# Altium schematic sheet [09] - USB.SchDoc
size A2; DocumentNumber: 9; SheetNumber: 9; SheetTotal: 18
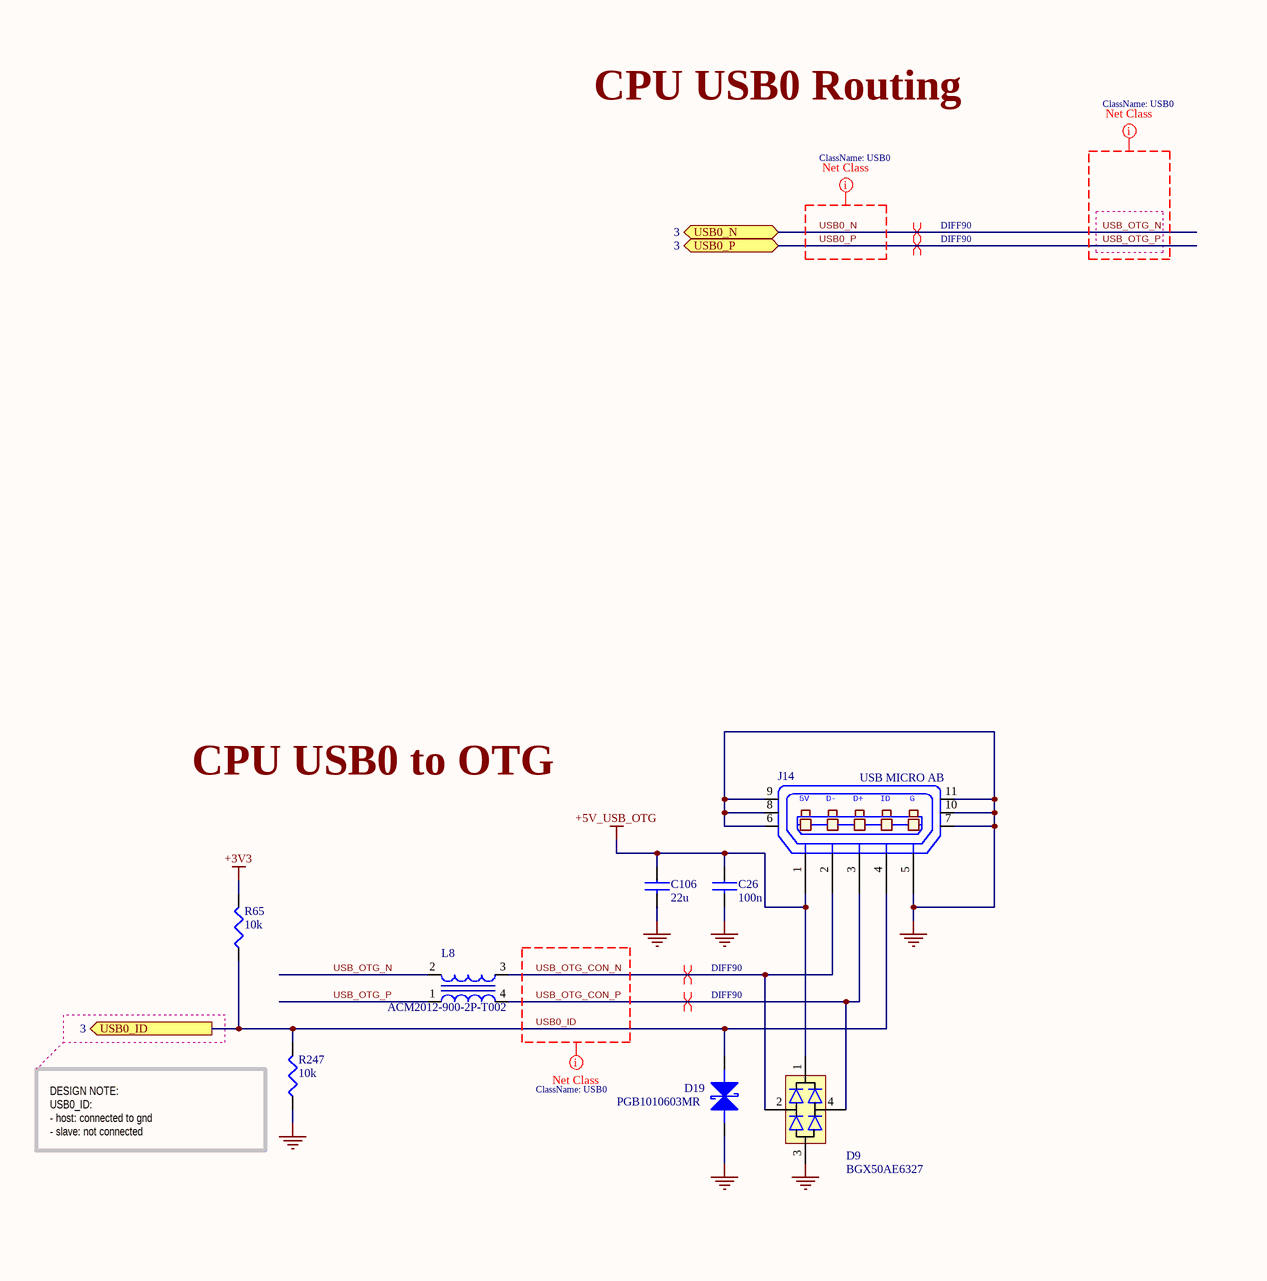
[diagram p0: [09] - USB.SchDoc, left]
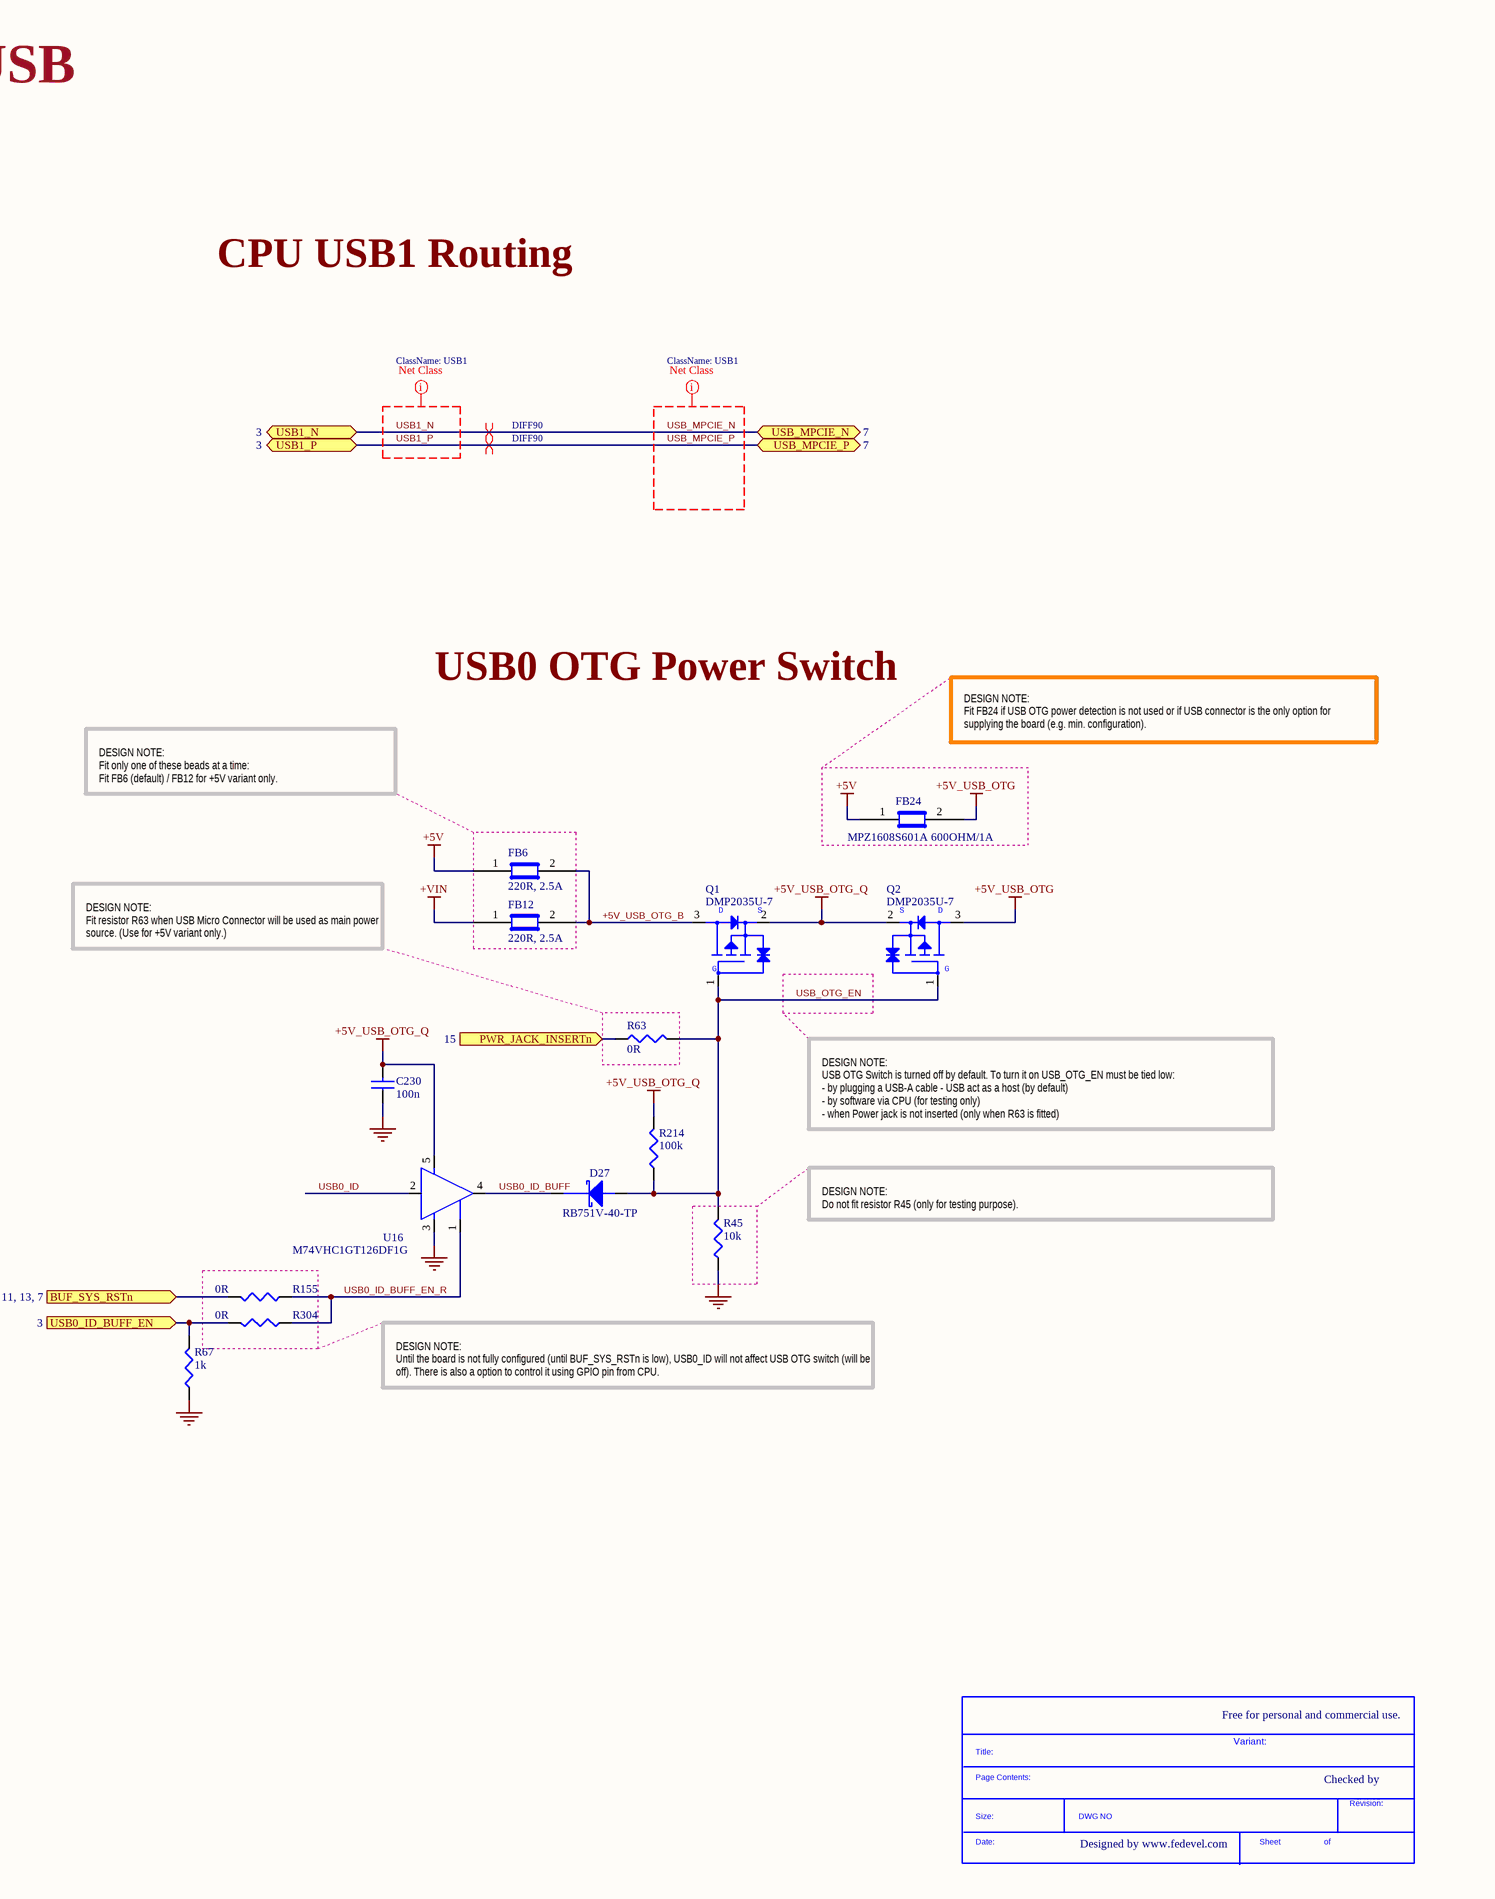
[diagram p1: [09] - USB.SchDoc, right]

## Parts
*  SDTitleBlock  (value not drawn)  (graphical)
C26  100n  [C0402]
C106  22u  [C0805]
C230  100n  [C0402]
D9  BGX50AE6327  [SOT143]
D19  PGB1010603MR  [C0603]
D27  RB751V-40-TP  [SOD323]
FB6  220R, 2.5A  [C0603]
FB12  220R, 2.5A  [C0603]
FB24  MPZ1608S601A 600OHM/1A  [C0603]
J14  USB MICRO AB  [USB_Micro_AB]
L8  ACM2012-900-2P-T002  [ACM2012]
Q1  DMP2035U-7  [SOT-23-3-123]
Q2  DMP2035U-7  [SOT-23-3-123]
R45  10k  [R0402]
R63  0R  [R0402]
R65  10k  [R0402]
R67  1k  [R0402]
R155  0R  [R0402]
R214  100k  [R0402]
R247  10k  [R0402]
R304  0R  [R0402]
U16  M74VHC1GT126DF1G  [SC70_5]

## Ports
BUF_SYS_RSTn (see 11, 13, 7), PWR_JACK_INSERTn (in, see 15), USB0_ID (out, see 3), USB0_ID_BUFF_EN (in, see 3), USB0_N (bidir, see 3), USB0_P (bidir, see 3), USB1_N (bidir, see 3), USB1_P (bidir, see 3), USB_MPCIE_N (bidir, see 7), USB_MPCIE_P (bidir, see 7)

## Nets
+3V3: R65.2
+5V: FB6.1 FB24.1
+5V_USB_OTG: C26.1 C106.1 D9.1 FB24.2 J14.1(P1) Q2.3
+5V_USB_OTG_Q: C230.2 Q1.2 Q2.2 R214.2 U16.5(VCC)
+VIN: FB12.1
GND: C26.2 C106.2 C230.1 D9.3 D19.2 J14.5(P5) J14.6 J14.7 J14.8 J14.9 J14.10 J14.11 R45.1 R67.1 R247.1 U16.3(GND)
+5V_USB_OTG_B: FB6.2 FB12.2 Q1.3
BUF_SYS_RSTn: R155.2 ; port BUF_SYS_RSTn
PWR_JACK_INSERTn: R63.1 ; port PWR_JACK_INSERTn
USB0_ID: D19.1 J14.4(P4) R65.1 R247.2 U16.2(I) ; port USB0_ID
USB0_ID_BUFF: D27.1(cathode) U16.4(O)
USB0_ID_BUFF_EN: R67.2 R304.2 ; port USB0_ID_BUFF_EN
USB0_ID_BUFF_EN_R: R155.1 R304.1 U16.1(OE#)
USB0_N: L8.2 ; port USB0_N  [also labelled USB_OTG_N]
USB0_P: L8.1 ; port USB0_P  [also labelled USB_OTG_P]
USB1_N: port USB1_N, port USB_MPCIE_N  [also labelled USB_MPCIE_N]
USB1_P: port USB1_P, port USB_MPCIE_P  [also labelled USB_MPCIE_P]
USB_OTG_CON_N: D9.2 J14.2(P2) L8.3
USB_OTG_CON_P: D9.4 J14.3(P3) L8.4
USB_OTG_EN: D27.2(ANODE) Q1.1 Q2.1 R45.2 R63.2 R214.1

## Layout directives
differential pair; net class DIFF90: USB0_N, USB0_P, USB1_N, USB1_P, USB_OTG_CON_N, USB_OTG_CON_P
net class USB0: USB0_ID, USB0_N, USB0_P, USB_OTG_CON_N, USB_OTG_CON_P, USB_OTG_N, USB_OTG_P
net class USB1: USB1_N, USB1_P, USB_MPCIE_N, USB_MPCIE_P

## Notes on the sheet
- USB
- CPU USB0 Routing
- CPU USB1 Routing
- USB0 OTG Power Switch
- DESIGN NOTE:
  Fit FB24 if USB OTG power detection is not used or if USB connector is the only option for supplying the board (e.g. min. configuration).
- DESIGN NOTE:
  Fit only one of these beads at a time:
  Fit FB6 (default) / FB12 for +5V variant only.
- CPU USB0 to OTG
- DESIGN NOTE:
  Fit resistor R63 when USB Micro Connector will be used as main power source. (Use for +5V variant only.)
- DESIGN NOTE:
  USB OTG Switch is turned off by default. To turn it on USB_OTG_EN must be tied low:
  - by plugging a USB-A cable - USB act as a host (by default)
  - by software via CPU (for testing only)
  - when Power jack is not inserted (only when R63 is fitted)
- DESIGN NOTE:
  Do not fit resistor R45 (only for testing purpose).
- (near R247) DESIGN NOTE:
  USB0_ID:
  - host: connected to gnd
  - slave: not connected
- DESIGN NOTE:
  Until the board is not fully configured (until BUF_SYS_RSTn is low), USB0_ID will not affect USB OTG switch (will be off). There is also a option to control it using GPIO pin from CPU.
- Free for personal and commercial use.
- Variant:
- Checked by
- Designed by www.fedevel.com
- (in symbol 0475890001) 5V; D-; D+; ID; G
- (in symbol DMP2035U-7) D; S; G
- (in symbol SDTitleBlock) Title:; Page Contents:; Revision:; Size:; DWG NO; Date:; Sheet; of

## Library data of the parts
C26 C230 = C1005X5R1H104K: CAP CER .10UF 50V X5R 10% 0402; Manufacturer: TDK Corporation; Capacitance: 0.1µF; Value: 100nF; .Checked PCB: used; Category: Capacitors; Supplier Part Number: 445-5942-1-ND; Manufacturer Part Number: C1005X5R1H104K; Operating Temperature: -55°C ~ 85°C; Package / Case: 0402 (1005 Metric); Price 1k [$]: 0.02340; .Checked SCH: used; Voltage - Rated: 50V; Supplier: Digikey; Supplier 1: Digi-Key; Supplier Part Number 1: 445-5942-1-ND; RoHS: RoHS Compliant; Stock 1: 106926; Pricing 1: 1=0.27, 10=0.18, 100=0.072, 250=0.05176, 500=0.0369, 1000=0.027 (USD); Tolerance: ±10%; Temperature Coefficient: X5R; Mounting Type: Surface Mount, MLCC; Applications: General Purpose; Ratings: -; Size / Dimension: 0.039" L x 0.020" W (1.00mm x 0.50mm); Height - Seated (Max): -; Thickness (Max): 0.022" (0.55mm); Lead Spacing: -; Features: -; Packaging: Cut Tape (CT); Lead Style: -; ComponentLink1URL: http://www.tdk.co.jp/tefe02/e412_c.pdf; ComponentLink1Description: http://www.tdk.co.jp/tefe02/e412_c.pdf
C106 = C2012X5R1C226K: CAP CER 22UF 16V 10% X5R 0805; Manufacturer: TDK Corporation; Capacitance: 22µF; .Checked PCB: RF; Supplier 1: Digi-Key; Supplier Part Number 1: 445-6797-1-ND; Manufacturer Part Number: C2012X5R1C226K; RoHS: RoHS Compliant; Category: Capacitors; Stock 1: 15408; Pricing 1: 1=0.77, 10=0.737, 100=0.3575, 250=0.297, 500=0.2695, 1000=0.2475 (USD); Voltage - Rated: 16V; Tolerance: ±10%; Temperature Coefficient: X5R; Mounting Type: Surface Mount, MLCC; Operating Temperature: -55°C ~ 85°C; Applications: General Purpose; Ratings: -; Package / Case: 0805 (2012 Metric); Size / Dimension: 0.079" L x 0.049" W (2.00mm x 1.25mm); Height - Seated (Max): -; Thickness (Max): 0.057" (1.45mm); Lead Spacing: -; Features: -; Packaging: Cut Tape (CT); Lead Style: -; ComponentLink1URL: http://www.tdk.com/pdf/general_B11.pdf; ComponentLink1Description: http://www.tdk.com/pdf/general_B11.pdf; .Checked SCH: RF
D9 = BGX50AE6327: DIODE SWITCHING 50V SOT-143; Manufacturer: Infineon Technologies; .Checked PCB: used; Current - DC Forward (If): 140mA; Diode Type: Single Phase; Speed: Small Signal =< 200mA (Io), Any Speed; Reverse Recovery Time (trr): 6ns; .Checked SCH: used; Category: Discrete Semiconductor Products; Family: Bridge Rectifiers; Manufacturer Part Number: BGX50AE6327; Package / Case: TO-253-4, TO-253AA; Price 1k [$]: 0.10013; Supplier: Digikey; Supplier Part Number: BGX50AINCT-ND; Value: BGX50AE6327; Supplier 1: Digi-Key; Supplier Part Number 1: BGX50AINCT-ND; RoHS: RoHS Compliant; Stock 1: 438; Pricing 1: 1=0.47, 10=0.334, 100=0.2225, 500=0.12906, 1000=0.10013 (USD); Voltage - Peak Reverse (Max): 50V; Mounting Type: Surface Mount; Packaging: Cut Tape (CT); Supplier Device Package: PG-SOT143-4; ComponentLink1URL: http://www.infineon.com/dgdl/bgx50aseries.pdf?folderId=db3a30431400ef6801141cc1c4cd04e8&fileId=db3a30431400ef6801141cc423c404e9; ComponentLink1Description: http://www.infineon.com/dgdl/bgx50aseries.pdf?folderId=db3a30431400ef6801141cc1c4cd04e8&fileId=db3a30431400ef6801141cc423c404e9
D19 = PGB1010603MR: SUPPRESSOR ESD 24VDC 0603 SMD; Manufacturer: Littelfuse Inc; Voltage - Reverse Standoff (Typ): 24V; Polarization: Bidirectional; .Creator: MM; .Checked PCB: used; Supplier 1: Digi-Key; Manufacturer Part Number: PGB1010603MR; RoHS: RoHS Compliant; Category: Circuit Protection; Stock 1: 155406; Pricing 1: 1=0.66, 10=0.556, 25=0.4872, 100=0.4172, 250=0.3618, 500=0.30646 (USD); Packaging: Cut Tape (CT); Voltage - Breakdown: -; Power (Watts): -; Mounting Type: Surface Mount; Package / Case: 0603 (1608 Metric); Supplier Device Package: 0603 (1608 Metric); ComponentLink1URL: http://www.littelfuse.com/data/en/Data_Sheets/Littelfuse_PulseGuard-ESD_PGB1.pdf; ComponentLink1Description: http://www.littelfuse.com/data/en/Data_Sheets/Littelfuse_PulseGuard-ESD_PGB1.pdf; Supplier Part Number 1: F2594CT-ND; .Checked SCH: used
D27 = RB751V-40-TP: DIODE SCHTKY 30MA 30V SOD-323; Manufacturer: Micro Commercial Co; Diode Type: Schottky; Voltage - Forward (Vf) (Max) @ If: 370mV @ 1mA; Speed: Small Signal =< 200mA (Io), Any Speed; Current - Reverse Leakage @ Vr: 500nA @ 30V; Capacitance @ Vr, F: 2pF @ 1V, 1MHz; .Checked PCB: used; Supplier 1: Digi-Key; Supplier Part Number 1: RB751V-40-TPMSCT-ND; Manufacturer Part Number: RB751V-40-TP; RoHS: RoHS Compliant; Category: Discrete Semiconductor Products; Stock 1: 18964; Pricing 1: 1=0.48, 10=0.342, 100=0.2014, 250=0.14252, 500=0.1216, 1000=0.095 (USD); Voltage - DC Reverse (Vr) (Max): 30V; Current - Average Rectified (Io): 30mA; Reverse Recovery Time (trr): -; Mounting Type: Surface Mount; Package / Case: SC-76, SOD-323; Supplier Device Package: SOD-323; Packaging: Cut Tape (CT); ComponentLink1URL: http://61.222.192.61/mccsemi/up_pdf/RB751V-40(SOD-323).PDF; ComponentLink1Description: http://61.222.192.61/mccsemi/up_pdf/RB751V-40(SOD-323).PDF; .Checked SCH: used
FB6 FB12 = BLM18SG221TN1D: FERRITE CHIP 220 OHM 2500MA 0603; Manufacturer: Murata Electronics North America; Impedance @ Frequency: 220 Ohm @ 100MHz; DC Resistance (DCR): 40 mOhm Max; Filter Type: Differential Mode - Single; Number of Lines: 1; .Checked PCB: used; Supplier 1: Digi-Key; Supplier Part Number 1: 490-5225-1-ND; Manufacturer Part Number: BLM18SG221TN1D; RoHS: RoHS Compliant; Category: Filters; Stock 1: 54640; Pricing 1: 1=0.38, 10=0.282, 50=0.1646, 100=0.1316, 250=0.094, 500=0.06392, 1000=0.0517, 5000=0.04042 (USD); Current Rating: 2.5A; Package / Case: 0603 (1608 Metric); Mounting Type: Surface Mount; Packaging: Cut Tape (CT); Height (Max): 0.037" (0.95mm); Size / Dimension: 0.063" L x 0.031" W (1.60mm x 0.80mm); ComponentLink1URL: http://search.murata.co.jp/Ceramy/image/img/PDF/ENG/L0110S0100BLM18S.pdf; ComponentLink1Description: http://search.murata.co.jp/Ceramy/image/img/PDF/ENG/L0110S0100BLM18S.pdf; .Checked SCH: used
FB24 = MPZ1608S601A: FERRITE CHIP BEAD 600 OHM SMD 1A; Manufacturer: TDK Corporation; Impedance @ Frequency: 600 Ohm @ 100MHz; DC Resistance (DCR): 150 mOhm Max; Filter Type: Differential Mode - Single; Number of Lines: 1; .Checked PCB: used; Supplier 1: Digi-Key; Supplier Part Number 1: 445-2205-1-ND; Manufacturer Part Number: MPZ1608S601A; RoHS: RoHS Compliant; Category: Filters; Stock 1: 328345; Pricing 1: 1=0.36, 10=0.24, 100=0.096, 250=0.069, 500=0.0492, 1000=0.036 (USD); Current Rating: 1A; Package / Case: 0603 (1608 Metric); Mounting Type: Surface Mount; Packaging: Cut Tape (CT); Height (Max): 0.037" (0.95mm); Size / Dimension: 0.063" L x 0.031" W (1.60mm x 0.80mm); ComponentLink1URL: http://www.tdk.co.jp/tefe02/e9413_mpz.pdf; ComponentLink1Description: http://www.tdk.co.jp/tefe02/e9413_mpz.pdf; .Checked SCH: used
J14 = 0475890001: CONN RCPT MICRO USB AB R/A SMD; Manufacturer: Molex Inc; Connector Type: USB - micro AB; Number of Contacts: 5; Gender: Receptacle; .Creator: MM; .Checked PCB: used; Supplier 1: Digi-Key; Manufacturer Part Number: 0475890001; RoHS: RoHS Compliant; Category: Connectors, Interconnects; Stock 1: 12754; Pricing 1: 1=0.81, 10=0.764, 25=0.6872, 50=0.6108, 100=0.5854, 250=0.53452, 500=0.50908 (USD); Packaging: Cut Tape (CT); Specifications: -; Mounting Type: Surface Mount, Right Angle, Horizontal; Features: Board Guide, Shielded; Ingress Protection: -; ComponentLink1URL: http://www.molex.com/pdm_docs/sd/475890001_sd.pdf; ComponentLink1Description: http://www.molex.com/pdm_docs/sd/475890001_sd.pdf; Supplier Part Number 1: WM17143CT-ND; .Checked SCH: used
L8 = ACM2012-900-2P-T002: CHOKE COMM MODE 90 OHM .4A SMD; Manufacturer: TDK Corporation; Filter Type: Data, Signal Line; Number of Lines: 2; Current: 400mA; DC Resistance (DCR): 190 mOhm Max; Impedance: 90 Ohm; Resistance (Ohms): 8.2K; Power (Watts): 0.063W, 1/16W; Temperature Coefficient: ±100ppm/°C; Tolerance: ±1%; .Checked PCB: used; Supplier 1: Digi-Key; Supplier Part Number 1: 445-2207-1-ND; Manufacturer Part Number: ACM2012-900-2P-T002; RoHS: RoHS Compliant; Category: Filters; Stock 1: 175768; Pricing 1: 1=0.48, 10=0.448, 50=0.42, 100=0.364, 500=0.308, 1000=0.252 (USD); Inductance: -; Mounting Type: Surface Mount; Size / Dimension: 0.079" L x 0.047" W (2.00mm x 1.20mm); Height (Max): 0.051" (1.30mm); Package / Case: 0805 (2012 Metric), 4 Lead; Operating Temperature: -25°C ~ 85°C; Packaging: Cut Tape (CT); ComponentLink1URL: http://www.tdk.co.jp/tefe02/e9719_acm2012.pdf; ComponentLink1Description: http://www.tdk.co.jp/tefe02/e9719_acm2012.pdf; Composition: Thick Film; Features: -; Height: 0.016" (0.40mm); Number of Terminations: 2; ComponentLink2URL: http://www.yageo.com/documents/recent/PYu-RC0402_51_RoHS_L_6.pdf; ComponentLink2Description: http://www.yageo.com/documents/recent/PYu-RC0402_51_RoHS_L_6.pdf; .Checked SCH: used
Q1 Q2 = DMP2035U-7: MOSFET P-CH 20V 3.6A SOT-23; Manufacturer: Diodes Incorporated; FET Type: MOSFET P-Channel, Metal Oxide; FET Feature: Logic Level Gate; Current - Continuous Drain (Id) @ 25°C: 3.6A (Ta); Rds On (Max) @ Id, Vgs: 35 mOhm @ 4A, 4.5V; Vgs(th) (Max) @ Id: 1V @ 250µA; Gate Charge (Qg) @ Vgs: 15.4nC @ 4.5V; Input Capacitance (Ciss) @ Vds: 1610pF @ 10V; Power - Max: 810mW; .Checked PCB: MM; Supplier 1: Digi-Key; Manufacturer Part Number: DMP2035U-7; RoHS: RoHS Compliant; Category: Discrete Semiconductor Products; Stock 1: 71721; Pricing 1: 1=0.49, 10=0.345, 25=0.2836, 100=0.2265, 250=0.165, 500=0.134, 1000=0.103 (USD); Packaging: Cut Tape (CT); Drain to Source Voltage (Vdss): 20V; Mounting Type: Surface Mount; Package / Case: TO-236-3, SC-59, SOT-23-3; Supplier Device Package: SOT-23-3; ComponentLink1URL: http://www.diodes.com/datasheets/ds31830.pdf; ComponentLink1Description: http://www.diodes.com/datasheets/ds31830.pdf; Supplier Part Number 1: DMP2035U-7DICT-ND; .Checked SCH: MM; .Creator: MM
R45 R65 R247 = RC0402FR-0710KL: RES 10.0K OHM 1/16W 1% 0402 SMD; Manufacturer: Yageo; Power (Watts): 0.063W, 1/16W; .Checked PCB: used; Temperature Coefficient: ±100ppm/°C; Category: Resistors; Supplier Part Number: 311-10.0KLRCT-ND; Manufacturer Part Number: RC0402FR-0710KL; Package / Case: 0402 (1005 Metric); Price 1k [$]: 0.01421; Resistance (Ohms): 10K; Tolerance: ±1%; Value: 10k; .Checked SCH: used; Supplier: Digikey; Supplier 1: Digi-Key; Supplier Part Number 1: 311-10.0KLRCT-ND; RoHS: RoHS Compliant; Stock 1: 2916495; Pricing 1: 10=0.014, 50=0.0104, 100=0.0079, 250=0.00584, 500=0.00432, 1000=0.00288 (USD); Composition: Thick Film; Features: -; Size / Dimension: 0.039" L x 0.020" W (1.00mm x 0.50mm); Height: 0.016" (0.40mm); Number of Terminations: 2; Packaging: Cut Tape (CT); ComponentLink1URL: http://www.yageo.com/documents/recent/PYu-RC0402_51_RoHS_L_6.pdf; ComponentLink1Description: http://www.yageo.com/documents/recent/PYu-RC0402_51_RoHS_L_6.pdf
R63 R155 R304 = RC0402JR-070RL: RES 0.0 OHM 1/16W 0402 SMD; Manufacturer: Yageo; Resistance (Ohms): 0.0; Power (Watts): 0.063W, 1/16W; Tolerance: Jumper; .Checked PCB: used; Category: Resistors; Supplier Part Number: 311-0.0JRCT-ND; Manufacturer Part Number: RC0402JR-070RL; Package / Case: 0402 (1005 Metric); Price 1k [$]: 0.01389; Value: 0R; .Checked SCH: used; Supplier: Digikey; Supplier 1: Digi-Key; Supplier Part Number 1: 311-0.0JRCT-ND; RoHS: RoHS Compliant; Stock 1: 1106330; Pricing 1: 10=0.012, 50=0.009, 100=0.0069, 250=0.00512, 500=0.0038, 1000=0.00253 (USD); Composition: Thick Film; Features: -; Temperature Coefficient: -; Size / Dimension: 0.039" L x 0.020" W (1.00mm x 0.50mm); Height: 0.016" (0.40mm); Number of Terminations: 2; Packaging: Cut Tape (CT); ComponentLink1URL: http://www.yageo.com/documents/recent/PYu-RC0402_51_RoHS_L_6.pdf; ComponentLink1Description: http://www.yageo.com/documents/recent/PYu-RC0402_51_RoHS_L_6.pdf
R67 = RC0402FR-071KL: RES 1.00K OHM 1/16W 1% 0402 SMD; Manufacturer: Yageo; Power (Watts): 0.063W, 1/16W; .Checked PCB: used; Temperature Coefficient: ±100ppm/°C; Category: Resistors; Supplier Part Number: 311-1.00KLRCT-ND; Manufacturer Part Number: RC0402FR-071KL; Package / Case: 0402 (1005 Metric); Price 1k [$]: 0.01421; Resistance (Ohms): 1K; Tolerance: ±1%; Value: 1k; .Checked SCH: used; Supplier: Digikey; Supplier 1: Digi-Key; Supplier Part Number 1: 311-1.00KLRCT-ND; RoHS: RoHS Compliant; Stock 1: 1753477; Pricing 1: 10=0.014, 50=0.0104, 100=0.0079, 250=0.00584, 500=0.00432, 1000=0.00288 (USD); Composition: Thick Film; Features: -; Size / Dimension: 0.039" L x 0.020" W (1.00mm x 0.50mm); Height: 0.016" (0.40mm); Number of Terminations: 2; Packaging: Cut Tape (CT); ComponentLink1URL: http://www.yageo.com/documents/recent/PYu-RC0402_51_RoHS_L_6.pdf; ComponentLink1Description: http://www.yageo.com/documents/recent/PYu-RC0402_51_RoHS_L_6.pdf
R214 = RMCF0402FT100K: RES 100K OHM 1/16W 1% 0402 SMD; Manufacturer: Stackpole Electronics Inc; Power (Watts): 0.063W, 1/16W; .Checked PCB: used; Temperature Coefficient: ±100ppm/°C; Category: Resistors; Supplier Part Number: RMCF0402FT100KCT-ND; Manufacturer Part Number: RMCF0402FT100K; Package / Case: 0402 (1005 Metric); Price 1k [$]: 0.00384; Resistance (Ohms): 100K; Tolerance: ±1%; Value: 100k; .Checked SCH: used; Supplier: Digikey; Supplier 1: Digi-Key; Supplier Part Number 1: RMCF0402FT100KCT-ND; RoHS: RoHS Compliant; Stock 1: 95; Pricing 1: 1=0.04, 10=0.025, 50=0.0138, 100=0.0105, 250=0.0078, 500=0.00576, 1000=0.00384 (USD); Composition: Thick Film; Features: -; Size / Dimension: 0.039" L x 0.020" W (1.00mm x 0.50mm); Height: 0.016" (0.40mm); Number of Terminations: 2; Packaging: Cut Tape (CT); ComponentLink1URL: http://www.seielect.com/Catalog/SEI-RMCF.pdf; ComponentLink1Description: http://www.seielect.com/Catalog/SEI-RMCF.pdf
U16 = M74VHC1GT126DF1G: IC BUFF CMOS LVL/SFTR N-I SOT353; Manufacturer: ON Semiconductor; Logic Type: Buffer/Line Driver, Non-Inverting; Number of Elements: 1; Current - Output High, Low: 8mA, 8mA; Voltage - Supply: 3 V ~ 5.5 V; .Checked PCB: MM; Supplier 1: Digi-Key; Manufacturer Part Number: M74VHC1GT126DF1G; RoHS: RoHS Compliant; Category: Integrated Circuits (ICs); Stock 1: 6821; Pricing 1: 1=0.36, 10=0.326, 25=0.2344, 100=0.1824, 250=0.1146, 500=0.09766, 1000=0.06654 (USD); Packaging: Cut Tape (CT); Number of Bits per Element: 1; Operating Temperature: -55°C ~ 125°C; Mounting Type: Surface Mount; Package / Case: 5-TSSOP, SC-70-5, SOT-353; Supplier Device Package: SC-70; ComponentLink1URL: http://www.onsemi.com/pub_link/Collateral/MC74VHC1GT126-D.PDF; ComponentLink1Description: http://www.onsemi.com/pub_link/Collateral/MC74VHC1GT126-D.PDF; Supplier Part Number 1: M74VHC1GT126DF1GOSCT-ND; .Checked SCH: MM; .Creator: MM